# Altium project PCB_Project.PrjPcb
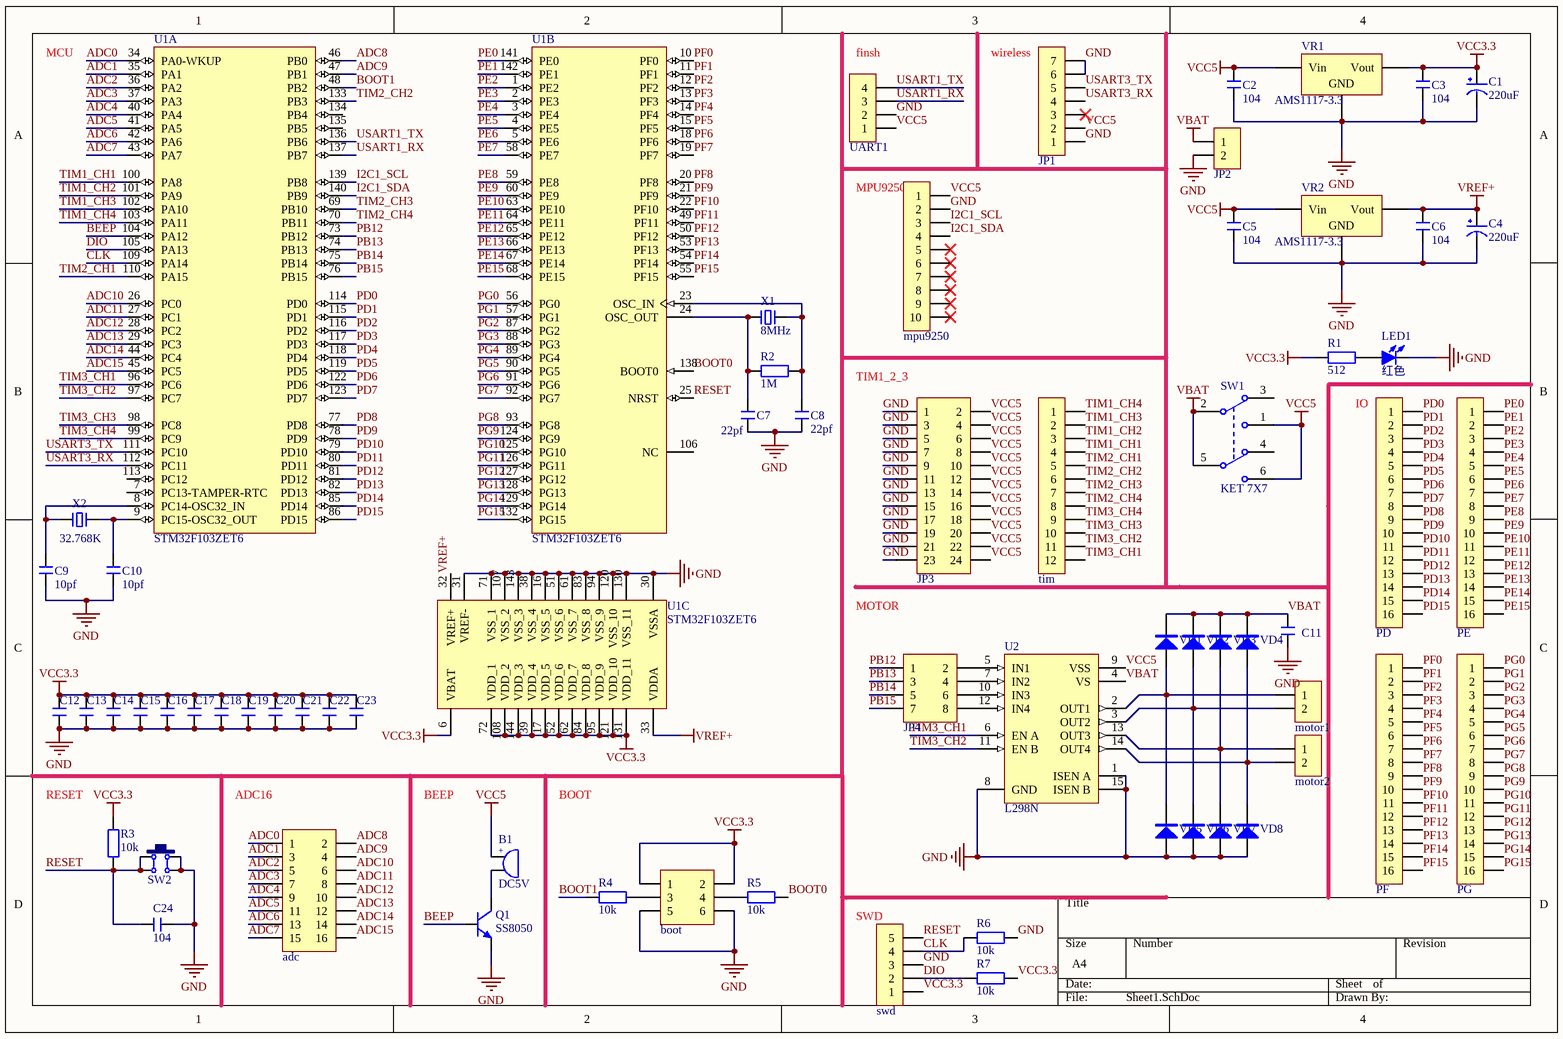
[diagram p0: Sheet1.SchDoc]
1 sheet, 66 parts. Net scope: global (net labels, ports and power ports of the same name join across sheets).
Board file: PCB1.PcbDoc

## Sheet Sheet1.SchDoc
size A4

### Parts
adc  Header 8X2  [HDR-8X2]  (value not drawn)
B1  DC5V  [BEEP 5x9x5.5]
boot  Header3X2  [HDR2X3]  (value not drawn)
C1  220uF  [CC6.56.5]
C2  104  [0805]
C3  104  [0805]
C4  220uF  [CC6.56.5]
C5  104  [0805]
C6  104  [0805]
C7  22pf  [0805]
C8  22pf  [0805]
C9  10pf  [0805]
C10  10pf  [0805]
C11  104  [C 0805]  (value not drawn)
C12  104  [C 0805]  (value not drawn)
C13  104  [C 0805]  (value not drawn)
C14  104  [C 0805]  (value not drawn)
C15  104  [C 0805]  (value not drawn)
C16  104  [C 0805]  (value not drawn)
C17  104  [C 0805]  (value not drawn)
C18  104  [C 0805]  (value not drawn)
C19  104  [C 0805]  (value not drawn)
C20  104  [C 0805]  (value not drawn)
C21  104  [C 0805]  (value not drawn)
C22  104  [C 0805]  (value not drawn)
C23  104  [C 0805]  (value not drawn)
C24  104  [0805]
JP1  HDR-1X7  [HDR-1X7_M]  (value not drawn)
JP2  HDR-1X2  [KF350-2P]  (value not drawn)
JP3  Header 2X11  [HDR-12X2]  (value not drawn)
JP4  Header 4X2  [HDR-4X2]  (value not drawn)
LED1  红色  [LED 3MM-R]
motor1  HDR-1X2  [KF128-3.81-2P]  (value not drawn)
motor2  HDR-1X2  [KF128-3.81-2P]  (value not drawn)
mpu9250  HDR-1X10  [HDR-1X10_M]  (value not drawn)
PD  HDR-1X16  [HDR-1X16]  (value not drawn)
PE  HDR-1X16  [HDR-1X16]  (value not drawn)
PF  HDR-1X16  [HDR-1X16]  (value not drawn)
PG  HDR-1X16  [HDR-1X16]  (value not drawn)
Q1  SS8050  [TO92A]
R1  512  [0805]
R2  1M  [0805]
R3  10k  [0805]
R4  10k  [0805]
R5  10k  [0805]
R6  10k  [R 0805]
R7  10k  [R 0805]
SW1  KET 7X7  [KFT DIP-7X7]
SW2  6x6x5  [TSW DIP-6*6*5]  (value not drawn)
swd  HDR-1X5  [HDR-1X5]  (value not drawn)
tim  HDR-1X12  [HDR-1X12_M]  (value not drawn)
U1  STM32F103ZET6  [STM-LQFP144_M]  (parts A,B,C of 3)
U2  L298N  [Multiwatt15V]
UART1  HDR-1X4  [HDR1X4]  (value not drawn)
VD1  1N4007  [SMA]  (value not drawn)
VD2  1N4007  [SMA]  (value not drawn)
VD3  1N4007  [SMA]  (value not drawn)
VD4  1N4007  [SMA]  (value not drawn)
VD5  1N4007  [SMA]  (value not drawn)
VD6  1N4007  [SMA]  (value not drawn)
VD7  1N4007  [SMA]  (value not drawn)
VD8  1N4007  [SMA]  (value not drawn)
VR1  AMS1117-3.3  [SOT-223]
VR2  AMS1117-3.3  [SOT-223]
X1  8MHz  [XTAL-49S DIP]
X2  32.768K  [CAPR5-4X5]

### Nets
GND: boot.5 boot.6 C1.2(GND) C2.2 C3.2 C4.2(GND) C5.2 C6.2 C7.2 C8.2 C9.1 C10.1 C11.2 C12.2 C13.2 C14.2 C15.2 C16.2 C17.2 C18.2 C19.2 C20.2 C21.2 C22.2 C23.2 C24.2 JP1.1 JP1.6 JP1.7 JP2.2 JP3.1 JP3.3 JP3.5 JP3.7 JP3.9 JP3.11 JP3.13 JP3.15 JP3.17 JP3.19 JP3.21 JP3.23 LED1.2(K) mpu9250.2 Q1.1(E) R6.2 SW2.2 SW2.3 swd.3 U1.16(VSS_5) U1.30(VSSA) U1.31(VREF-) U1.38(VSS_4) U1.51(VSS_6) U1.61(VSS_7) U1.71(VSS_1) U1.83(VSS_8) U1.94(VSS_9) U1.107(VSS_2) U1.120(VSS_10) U1.130(VSS_11) U1.143(VSS_3) U2.1(ISEN_A) U2.8(GND) U2.15(ISEN_B) UART1.2 VD5.1(A) VD6.1(A) VD7.1(A) VD8.1(A) VR1.1(GND) VR2.1(GND)
VBAT: C11.1 JP2.1 SW1.2(COM2) SW1.5(COM2) U2.4(VS) VD1.2(K) VD2.2(K) VD3.2(K) VD4.2(K)
VCC3.3: boot.1 boot.2 C1.1(VCC) C3.1 C12.1 C13.1 C14.1 C15.1 C16.1 C17.1 C18.1 C19.1 C20.1 C21.1 C22.1 C23.1 R1.1 R3.2 R7.2 swd.1 U1.6(VBAT) U1.17(VDD_5) U1.39(VDD_4) U1.52(VDD_6) U1.62(VDD_7) U1.72(VDD_1) U1.84(VDD_8) U1.95(VDD_9) U1.108(VDD_2) U1.121(VDD_10) U1.131(VDD_11) U1.144(VDD_3) VR1.2(Vout)
VCC5: B1.1 C2.1 C5.1 JP1.2 JP3.2 JP3.4 JP3.6 JP3.8 JP3.10 JP3.12 JP3.14 JP3.16 JP3.18 JP3.20 JP3.22 JP3.24 mpu9250.1 SW1.1(NC1) SW1.6(NC2) U2.9(VSS) UART1.1 VR1.3(Vin) VR2.3(Vin)
VREF+: C4.1(VCC) C6.1 U1.32(VREF+) U1.33(VDDA) VR2.2(Vout)
ADC0: adc.1 U1.34(PA0-WKUP)
ADC1: adc.3 U1.35(PA1)
ADC2: adc.5 U1.36(PA2)
ADC3: adc.7 U1.37(PA3)
ADC4: adc.9 U1.40(PA4)
ADC5: adc.11 U1.41(PA5)
ADC6: adc.13 U1.42(PA6)
ADC7: adc.15 U1.43(PA7)
ADC8: adc.2 U1.46(PB0)
ADC9: adc.4 U1.47(PB1)
ADC10: adc.6 U1.26(PC0)
ADC11: adc.8 U1.27(PC1)
ADC12: adc.10 U1.28(PC2)
ADC13: adc.12 U1.29(PC3)
ADC14: adc.14 U1.44(PC4)
ADC15: adc.16 U1.45(PC5)
BEEP: Q1.2(B) U1.104(PA12)
BOOT0: R5.1 U1.138(BOOT0)
BOOT1: R4.1 U1.48(PB2)
CLK: R6.1 swd.4 U1.109(PA14)
DIO: R7.1 swd.2 U1.105(PA13)
I2C1_SCL: mpu9250.3 U1.139(PB8)
I2C1_SDA: mpu9250.4 U1.140(PB9)
PB12: JP4.1 U1.73(PB12)
PB13: JP4.3 U1.74(PB13)
PB14: JP4.5 U1.75(PB14)
PB15: JP4.7 U1.76(PB15)
PD0: PD.1 U1.114(PD0)
PD1: PD.2 U1.115(PD1)
PD2: PD.3 U1.116(PD2)
PD3: PD.4 U1.117(PD3)
PD4: PD.5 U1.118(PD4)
PD5: PD.6 U1.119(PD5)
PD6: PD.7 U1.122(PD6)
PD7: PD.8 U1.123(PD7)
PD8: PD.9 U1.77(PD8)
PD9: PD.10 U1.78(PD9)
PD10: PD.11 U1.79(PD10)
PD11: PD.12 U1.80(PD11)
PD12: PD.13 U1.81(PD12)
PD13: PD.14 U1.82(PD13)
PD14: PD.15 U1.85(PD14)
PD15: PD.16 U1.86(PD15)
PE0: PE.1 U1.141(PE0)
PE1: PE.2 U1.142(PE1)
PE2: PE.3 U1.1(PE2)
PE3: PE.4 U1.2(PE3)
PE4: PE.5 U1.3(PE4)
PE5: PE.6 U1.4(PE5)
PE6: PE.7 U1.5(PE6)
PE7: PE.8 U1.58(PE7)
PE8: PE.9 U1.59(PE8)
PE9: PE.10 U1.60(PE9)
PE10: PE.11 U1.63(PE10)
PE11: PE.12 U1.64(PE11)
PE12: PE.13 U1.65(PE12)
PE13: PE.14 U1.66(PE13)
PE14: PE.15 U1.67(PE14)
PE15: PE.16 U1.68(PE15)
PF0: PF.1 U1.10(PF0)
PF1: PF.2 U1.11(PF1)
PF2: PF.3 U1.12(PF2)
PF3: PF.4 U1.13(PF3)
PF4: PF.5 U1.14(PF4)
PF5: PF.6 U1.15(PF5)
PF6: PF.7 U1.18(PF6)
PF7: PF.8 U1.19(PF7)
PF8: PF.9 U1.20(PF8)
PF9: PF.10 U1.21(PF9)
PF10: PF.11 U1.22(PF10)
PF11: PF.12 U1.49(PF11)
PF12: PF.13 U1.50(PF12)
PF13: PF.14 U1.53(PF13)
PF14: PF.15 U1.54(PF14)
PF15: PF.16 U1.55(PF15)
PG0: PG.1 U1.56(PG0)
PG1: PG.2 U1.57(PG1)
PG2: PG.3 U1.87(PG2)
PG3: PG.4 U1.88(PG3)
PG4: PG.5 U1.89(PG4)
PG5: PG.6 U1.90(PG5)
PG6: PG.7 U1.91(PG6)
PG7: PG.8 U1.92(PG7)
PG8: PG.9 U1.93(PG8)
PG9: PG.10 U1.124(PG9)
PG10: PG.11 U1.125(PG10)
PG11: PG.12 U1.126(PG11)
PG12: PG.13 U1.127(PG12)
PG13: PG.14 U1.128(PG13)
PG14: PG.15 U1.129(PG14)
PG15: PG.16 U1.132(PG15)
RESET: C24.1 R3.1 SW2.1 SW2.4 swd.5 U1.25(NRST)
TIM1_CH1: tim.4 U1.100(PA8)
TIM1_CH2: tim.3 U1.101(PA9)
TIM1_CH3: tim.2 U1.102(PA10)
TIM1_CH4: tim.1 U1.103(PA11)
TIM2_CH1: tim.5 U1.110(PA15)
TIM2_CH2: tim.6 U1.133(PB3)
TIM2_CH3: tim.7 U1.69(PB10)
TIM2_CH4: tim.8 U1.70(PB11)
TIM3_CH1: tim.12 U1.96(PC6) U2.6(EN_A)
TIM3_CH2: tim.11 U1.97(PC7) U2.11(EN_B)
TIM3_CH3: tim.10 U1.98(PC8)
TIM3_CH4: tim.9 U1.99(PC9)
USART1_RX: U1.137(PB7) UART1.3
USART1_TX: U1.136(PB6) UART1.4
USART3_RX: JP1.4 U1.112(PC11)
USART3_TX: JP1.5 U1.111(PC10)
NetB1_2: B1.2 Q1.3(C)
Netboot_3: boot.3 R4.2
Netboot_4: boot.4 R5.2
NetC7_1: C7.1 R2.1 U1.24(OSC_OUT) X1.1
NetC8_1: C8.1 R2.2 U1.23(OSC_IN) X1.2
NetC9_2: C9.2 U1.8(PC14-OSC32_IN) X2.1
NetC10_2: C10.2 U1.9(PC15-OSC32_OUT) X2.2
NetJP4_2: JP4.2 U2.5(IN1)
NetJP4_4: JP4.4 U2.7(IN2)
NetJP4_6: JP4.6 U2.10(IN3)
NetJP4_8: JP4.8 U2.12(IN4)
NetLED1_1: LED1.1(A) R1.2
Netmotor1_1: motor1.1 U2.2(OUT1) VD1.1(A) VD5.2(K)
Netmotor1_2: motor1.2 U2.3(OUT2) VD2.1(A) VD6.2(K)
Netmotor2_1: motor2.1 U2.13(OUT3) VD3.1(A) VD7.2(K)
Netmotor2_2: motor2.2 U2.14(OUT4) VD4.1(A) VD8.2(K)

Not connected (* = marked no-connect by the designer): JP1 3*; mpu9250 5* 6* 7* 8* 9* 10*; SW1 3(NO1) 4(NO2); U1 7(PC13-TAMPER-RTC) 106(NC) 113(PC12) 134(PB4) 135(PB5)

### Notes on the sheet
- MCU
- (near UART1) finsh
- (near JP1) wireless
- (near mpu9250) MPU9250
- (near JP3) TIM1_2_3
- IO
- MOTOR
- (near R3) RESET
- (near adc) ADC16
- BEEP
- BOOT
- (near swd) SWD
- (in symbol BEEP) +

### Library data of the parts
adc = Header 8X2: 8*2P接插件; 版权归属: 源创客; BOM名称: 8*2P接插件; 学习资源: www.ooocke.com
B1 = BEEP: 蜂鸣器; 版权归属: 源创客; BOM名称: 蜂鸣器; 学习资源: www.ooocke.com
boot = Header 3X2: 3*2P接插件; 版权归属: 源创客; BOM名称: 3*2P接插件; 学习资源: www.ooocke.com
C1 C4 = CAP
C2 C3 C5-C24 = C: 无极性贴片电容; 版权归属: 源创客; BOM名称: 无极性贴片电容; 学习资源: www.ooocke.com
JP1 = Header 7: 7P接插件; 版权归属: 源创客; BOM名称: 7P接插件; 学习资源: www.ooocke.com
JP2 motor1 motor2 = Header 2: 2P接插件; 版权归属: 源创客; BOM名称: 2P接插件; 学习资源: www.ooocke.com
JP3 = Header 12X2: 12*2P接插件; 版权归属: 源创客; BOM名称: 12*2P接插件; 学习资源: www.ooocke.com
JP4 = Header 4X2: 4*2P接插件; 版权归属: 源创客; BOM名称: 4*2P接插件; 学习资源: www.ooocke.com
LED1 = LED-3MM: 插件LED; 版权归属: 源创客; BOM名称: 插件LED; 学习资源: www.ooocke.com
mpu9250 = Header 10: 10P接插件; 版权归属: 源创客; BOM名称: 10P接插件; 学习资源: www.ooocke.com
PD PE PF PG = Header 16: 16P接插件; 版权归属: 源创客; BOM名称: 16P接插件; 学习资源: www.ooocke.com
Q1 = 8050-DIP: 高频放大-NPN型; 版权归属: 源创客; 属性: 40V 1.5A 1W 100MHZ; BOM名称: 高频放大-NPN型; 学习资源: www.ooocke.com
R1-R7 = R: 贴片电阻; 版权归属: 源创客; BOM名称: 贴片电阻; 学习资源: www.ooocke.com
SW1 = KET 7X7: 7*7自锁开关; 版权归属: 源创客; BOM名称: 7*7自锁开关; 学习资源: www.ooocke.com
SW2 = TSW DIP-6x6: 直插6x6轻触开关; 版权归属: 源创客; BOM名称: 直插6x6轻触开关; 学习资源: www.ooocke.com
swd = Header 5: 5P接插件; 版权归属: 源创客; BOM名称: 5P接插件; 学习资源: www.ooocke.com
tim = Header 12: 12P接插件; 版权归属: 源创客; BOM名称: 12P接插件; 学习资源: www.ooocke.com
U1 = STM32F103ZET6: ARM Cortex-M3 32-bit MCU, 512 KB Flash, 64 KB Internal RAM, 112 I/Os, 144-pin LQFP, -40 to 85 degC, Tray; A/D Converter: 3x12-bit (21 Channel); D/A Converter: 2x12-bit (2 Channel); FLASH Size (Prog) (kB): 512; I/Os (High Current): 112; Internal RAM Size (kB): 64; Operating Frequency(F) (Processor speed) (MHz): 72; Supply Voltage(Vcc) min (V): 2; DatasheetVersion: Rev. 8; PackageVersion: Rev. 4, 06/2013; PackageReference: LQFP144; PackageDescription: 144-Pin Low Profile Quad Flat Package, 20 x 20 mm Body, 0.5 mm Pitch; Supplier 1: Digi-Key; Supplier Part Number 1: 497-6442-ND; Supplier 2: Farnell; Supplier Part Number 2: 1624145; Supplier 3: Newark; Supplier Part Number 3: 57P1270; Supplier 4: Mouser; Supplier Part Number 4: 511-STM32F103ZET6; Core: ARM Cortex-M3; Packing: Tray; Mounting Technology: Surface Mount; PartNumber: STM32F103ZET6; ComponentLink1Description: Manufacturer URL; ComponentLink1URL: http://www.st.com/web/en/home.html; ComponentLink2Description: Datasheet; ComponentLink2URL: http://www.st.com/st-web-ui/static/active/en/resource/technical/document/datasheet/CD00191185.pdf; ComponentLink3Description: Package Specification; ComponentLink3URL: http://www.st.com/st-web-ui/static/active/en/resource/technical/document/datasheet/DM00037051.pdf
U2 = L298N: Dual Full Bridge Driver; Published: 8-Jun-2000; LatestRevisionDate: 14-May-2007; LatestRevisionNote: Mapped to vertical PCB.; DatasheetVersion: Jul-1999; PackageReference: Multiwatt15V; Publisher: Altium Limited; PackageDescription: TO, Thru-Hole, Vertical, Heatsink Mounted; 15 Bent Staggered Leads; Pitch 1.27 mm; ComponentLink1Description: Manufacturer Link; ComponentLink1URL: http://www.st.com/; ComponentLink2Description: Datasheet; ComponentLink2URL: http://www.st.com/stonline/products/literature/ds/1773/l298.pdf
UART1 = Header 4: 4P接插件; 版权归属: 源创客; BOM名称: 4P接插件; 学习资源: www.ooocke.com
VD1-VD8 = 1N4007: 整流二极管; 版权归属: 源创客; BOM名称: 整流二极管; 学习资源: www.ooocke.com
VR1 VR2 = SOT-223 AMS1117-3.3: 低压差线性稳压(LDO); ComponentLink1Description: 供应商链接; ComponentLink1URL: http://www.szlcsc.com/product/details_6652.html; Package: SOT-223; Supplier: LC; SuppliersPartNumber: C6186
X1 X2 = XTAL-2: 2脚晶振; 版权归属: 源创客; BOM名称: 2脚晶振; 学习资源: www.ooocke.com